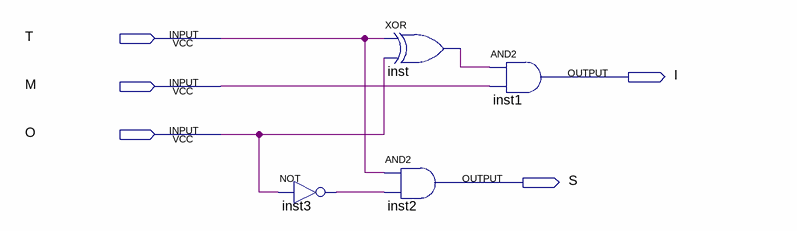
[diagram p0: schematic sheet]
// Quartus schematic BoothSelcond.bdf as structural Verilog: 4 symbols, 5 pins
module BoothSelcond (
  input  T,
  input  M,
  input  O,
  output I,
  output S
);

  wire inst3_out, inst_out;

  not inst3 (inst3_out, O);
  xor inst (inst_out, T, O);
  and inst2 (S, T, inst3_out);
  and inst1 (I, inst_out, M);
endmodule
